# EAGLE schematic esp12rgbww (EAGLE 7.7.0)
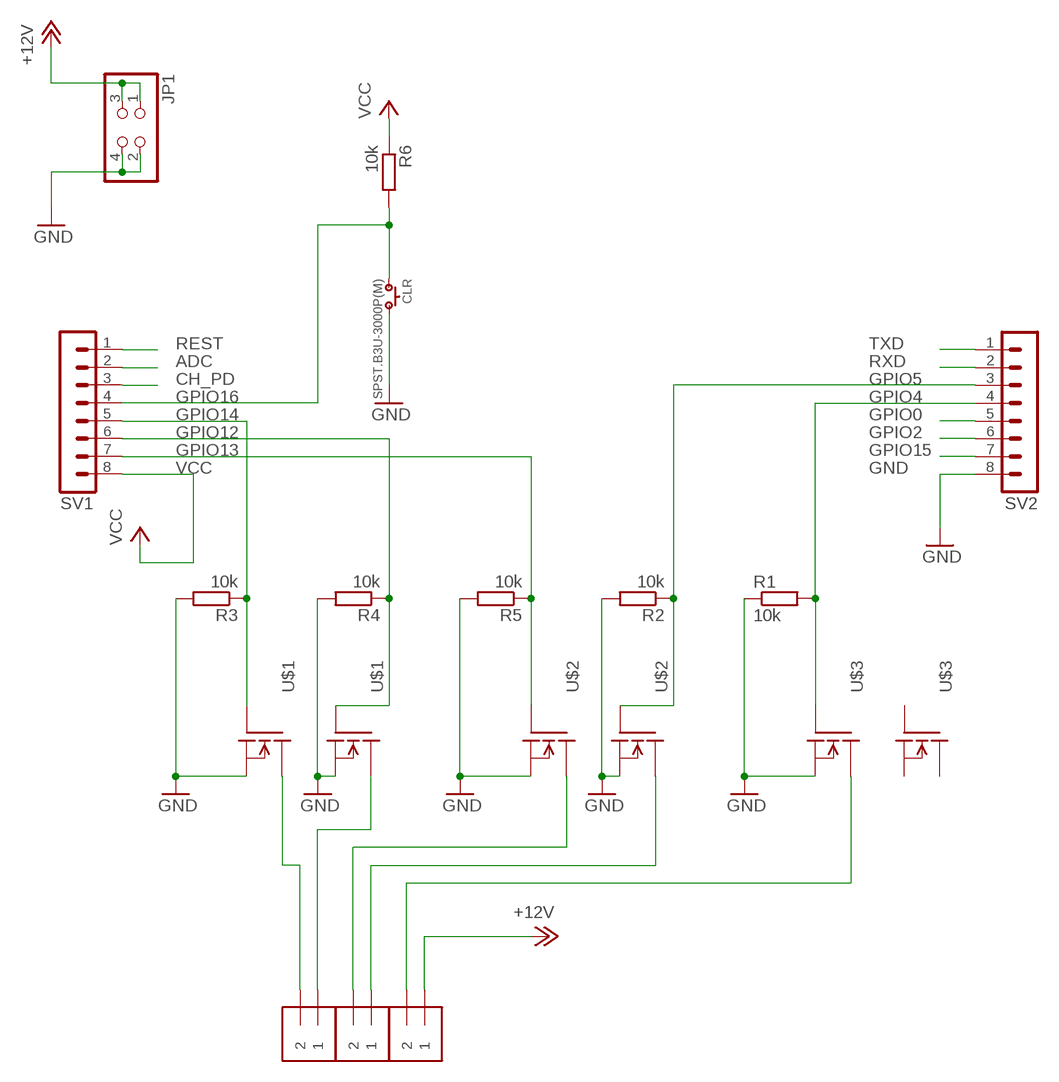
[diagram p0: schematic, sheet 1]

## Parts
CLR  SPST.B3U-3000P(M)  [B3U-3000P(M)]
J1  1X2-3.5MM  [1X2-3.5MM]
J2  1X2-3.5MM  [1X2-3.5MM]
J3  1X2-3.5MM  [1X2-3.5MM]
JP1  PINHD-2X2  [2X02]
R1  10k  R-EU_R0805  [R0805]
R2  10k  R-EU_R0805  [R0805]
R3  10k  R-EU_R0805  [R0805]
R4  10k  R-EU_R0805  [R0805]
R5  10k  R-EU_R0805  [R0805]
R6  10k  R-EU_R0805  [R0805]
SV1  MA08-1  [MA08-1]
SV2  MA08-1  [MA08-1]
U$1  AOD4806  [SO08]
U$2  AOD4806  [SO08]
U$3  AOD4806  [SO08]

## Nets
+12V: J3.1 JP1.1 JP1.3
ADC: SV1.2
B: J1.2 U$1.7(D1) U$1.8(D1)
CH_PD: SV1.3
CW: J2.1 U$2.5(D) U$2.6(D)
G: J1.1 U$1.5(D) U$1.6(D)
GND: CLR.2 JP1.2 JP1.4 R1.1 R2.2 R3.2 R4.2 R5.2 SV2.8 U$1.1(S1) U$1.3(S) U$2.1(S1) U$2.3(S) U$3.1(S1)
GPIO0: SV2.5
GPIO2: SV2.6
GPIO4: R1.2 SV2.4 U$3.2(G1)
GPIO5: R2.1 SV2.3 U$2.4(G)
GPIO12: R4.1 SV1.6 U$1.4(G)
GPIO13: R5.1 SV1.7 U$2.2(G1)
GPIO14: R3.1 SV1.5 U$1.2(G1)
GPIO15: SV2.7
GPIO16: CLR.1 R6.2 SV1.4
R: J2.2 U$2.7(D1) U$2.8(D1)
REST: SV1.1
RXD: SV2.2
TXD: SV2.1
VCC: R6.1 SV1.8
WW: J3.2 U$3.7(D1) U$3.8(D1)
Unconnected: U$3.3(S) U$3.4(G) U$3.5(D) U$3.6(D)

## Library data of the parts
CLR = omron:SPST
J1-J3 = adafruit:1X2: 3.5mm Terminal block http://www.ladyada.net/library/pcb/eaglelibrary.html
JP1 = pinhead:PINHD-2X2: PIN HEADER
R1-R6 = rcl:R-EU_: RESISTOR, European symbol
SV1 SV2 = con-lstb:MA08-1: PIN HEADER; OC_FARNELL: unknown; OC_NEWARK: unknown
U$1-U$3 = esp12_RGBWW:AOD4806

## Net classes
5 Signal: width 0.381 mm